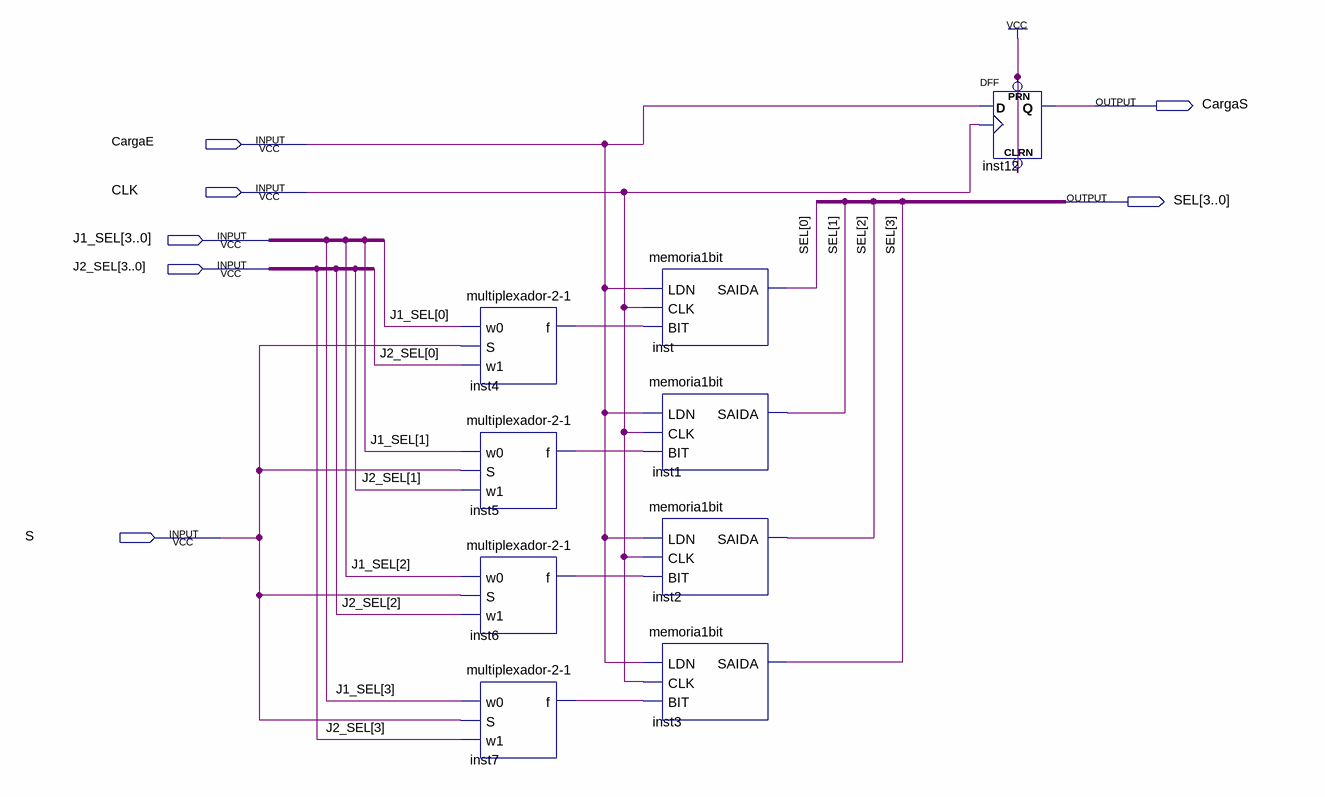
[diagram p0: schematic sheet]
// Quartus schematic selecionado_memoria.bdf as structural Verilog: 9 symbols, 7 pins
module selecionado_memoria (
  input  CargaE,
  input  CLK,
  input  [3:0] J1_SEL,
  input  [3:0] J2_SEL,
  input  S,
  output CargaS,
  output [3:0] SEL
);

  wire inst4_f, inst5_f, inst6_f, inst7_f;

  \multiplexador-2-1  inst4 (.w0(J1_SEL[0]), .S(S), .w1(J2_SEL[0]), .f(inst4_f));
  \multiplexador-2-1  inst5 (.w0(J1_SEL[1]), .S(S), .w1(J2_SEL[1]), .f(inst5_f));
  \multiplexador-2-1  inst6 (.w0(J1_SEL[2]), .S(S), .w1(J2_SEL[2]), .f(inst6_f));
  \multiplexador-2-1  inst7 (.w0(J1_SEL[3]), .S(S), .w1(J2_SEL[3]), .f(inst7_f));
  memoria1bit inst (.LDN(CargaE), .CLK(CLK), .BIT(inst4_f), .SAIDA(SEL[0]));
  memoria1bit inst1 (.LDN(CargaE), .CLK(CLK), .BIT(inst5_f), .SAIDA(SEL[1]));
  memoria1bit inst2 (.LDN(CargaE), .CLK(CLK), .BIT(inst6_f), .SAIDA(SEL[2]));
  memoria1bit inst3 (.LDN(CargaE), .CLK(CLK), .BIT(inst7_f), .SAIDA(SEL[3]));
  DFF inst12 (.CLRN(1'b1), .CLK(CLK), .D(CargaE), .PRN(1'b1), .Q(CargaS));
endmodule
